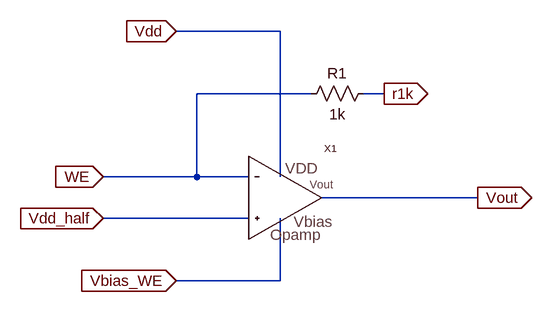
[diagram p0: schematic 1umiv_conv.asc]
1umiv_conv.asc, the LTspice schematic file:
Version 4
SHEET 1 880 680
WIRE 144 -64 -16 -64
WIRE 192 32 16 32
WIRE 304 32 272 32
WIRE 16 160 16 32
WIRE 16 160 -128 160
WIRE 96 160 16 160
WIRE 144 160 144 -64
WIRE 448 192 208 192
WIRE 96 224 -128 224
WIRE 144 320 144 224
WIRE 144 320 -16 320
FLAG -128 160 WE
IOPIN -128 160 In
FLAG -16 -64 Vdd
IOPIN -16 -64 In
FLAG -128 224 Vdd_half
IOPIN -128 224 In
FLAG -16 320 Vbias_WE
IOPIN -16 320 In
FLAG 304 32 r1k
IOPIN 304 32 Out
FLAG 448 192 Vout
IOPIN 448 192 Out
SYMBOL Opamp3ureiauto 176 192 R0
SYMATTR InstName X1
SYMBOL res 288 16 R90
WINDOW 0 0 56 VBottom 2
WINDOW 3 32 56 VTop 2
SYMATTR InstName R1
SYMATTR Value 1k

The netlist it stands for:
* 1umiv_conv.asc
XX1 WE Vdd_half Vout Vdd Vbias_WE Opamp3ureiauto  ; pins Vinm Vinp Vout VDD Vbias
R1 r1k WE 1k
.backanno
.end